# Altium schematic sheet ultra.SchDoc
size A1
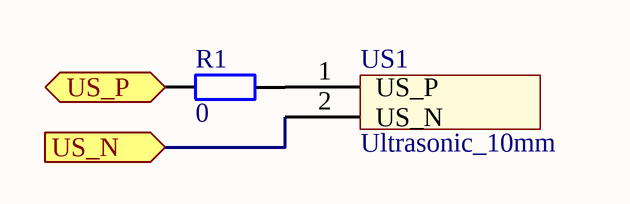
[diagram p0: ultra.SchDoc]

## Parts
R1  0  [R-0603-M]
US1  Ultrasonic_10mm  [ULTRA_10]

## Ports
US_N (in), US_P (in)

## Nets
US_N: US1.2(US_N) ; port US_N
US_P: R1.1 ; port US_P
NetR1_2: R1.2 US1.1(US_P)

## Library data of the parts
R1 = R-0603-0: Resistor 0; Supplier 1: Mouser; Supplier Part Number 1: 71-CRCW0603-0-E3; Resistance: 0